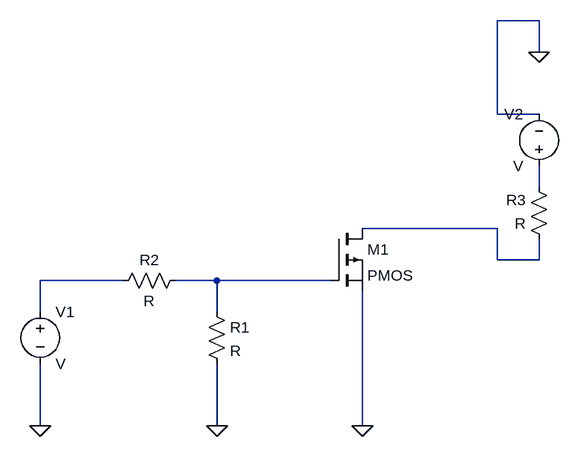
[diagram p0: schematic NOTgate.asc]
NOTgate.asc, the LTspice schematic file:
Version 4
SHEET 1 976 680
WIRE 688 -416 624 -416
WIRE 688 -368 688 -416
WIRE 624 -272 624 -416
WIRE 688 -272 624 -272
WIRE 688 -160 688 -192
WIRE 624 -96 416 -96
WIRE 624 -48 624 -96
WIRE 688 -48 688 -80
WIRE 688 -48 624 -48
WIRE 48 -16 -80 -16
WIRE 192 -16 128 -16
WIRE 368 -16 192 -16
WIRE -80 32 -80 -16
WIRE 192 32 192 -16
WIRE -80 208 -80 112
WIRE 192 208 192 112
WIRE 416 208 416 0
FLAG 416 208 0
FLAG 192 208 0
FLAG -80 208 0
FLAG 688 -368 0
SYMBOL voltage -80 16 R0
SYMATTR InstName V1
SYMBOL voltage 688 -176 R180
WINDOW 0 24 96 Left 2
WINDOW 3 24 16 Left 2
SYMATTR InstName V2
SYMBOL res 176 16 R0
SYMATTR InstName R1
SYMBOL res 144 -32 R90
WINDOW 0 0 56 VBottom 2
WINDOW 3 32 56 VTop 2
SYMATTR InstName R2
SYMBOL res 704 -64 R180
WINDOW 0 36 76 Left 2
WINDOW 3 36 40 Left 2
SYMATTR InstName R3
SYMBOL pmos 368 -96 R0
SYMATTR InstName M1

The netlist it stands for:
* NOTgate.asc
V1 N003 0 V
V2 N001 0 V
R1 N004 0 R
R2 N004 N003 R
R3 N002 N001 R
M1 N002 N004 0 0 PMOS
.model NMOS NMOS
.model PMOS PMOS
.lib standard.mos
.backanno
.end